# Altium schematic sheet Filter_R.SchDoc: Filter_R
size A3; SheetNumber: 1; SheetTotal: 5
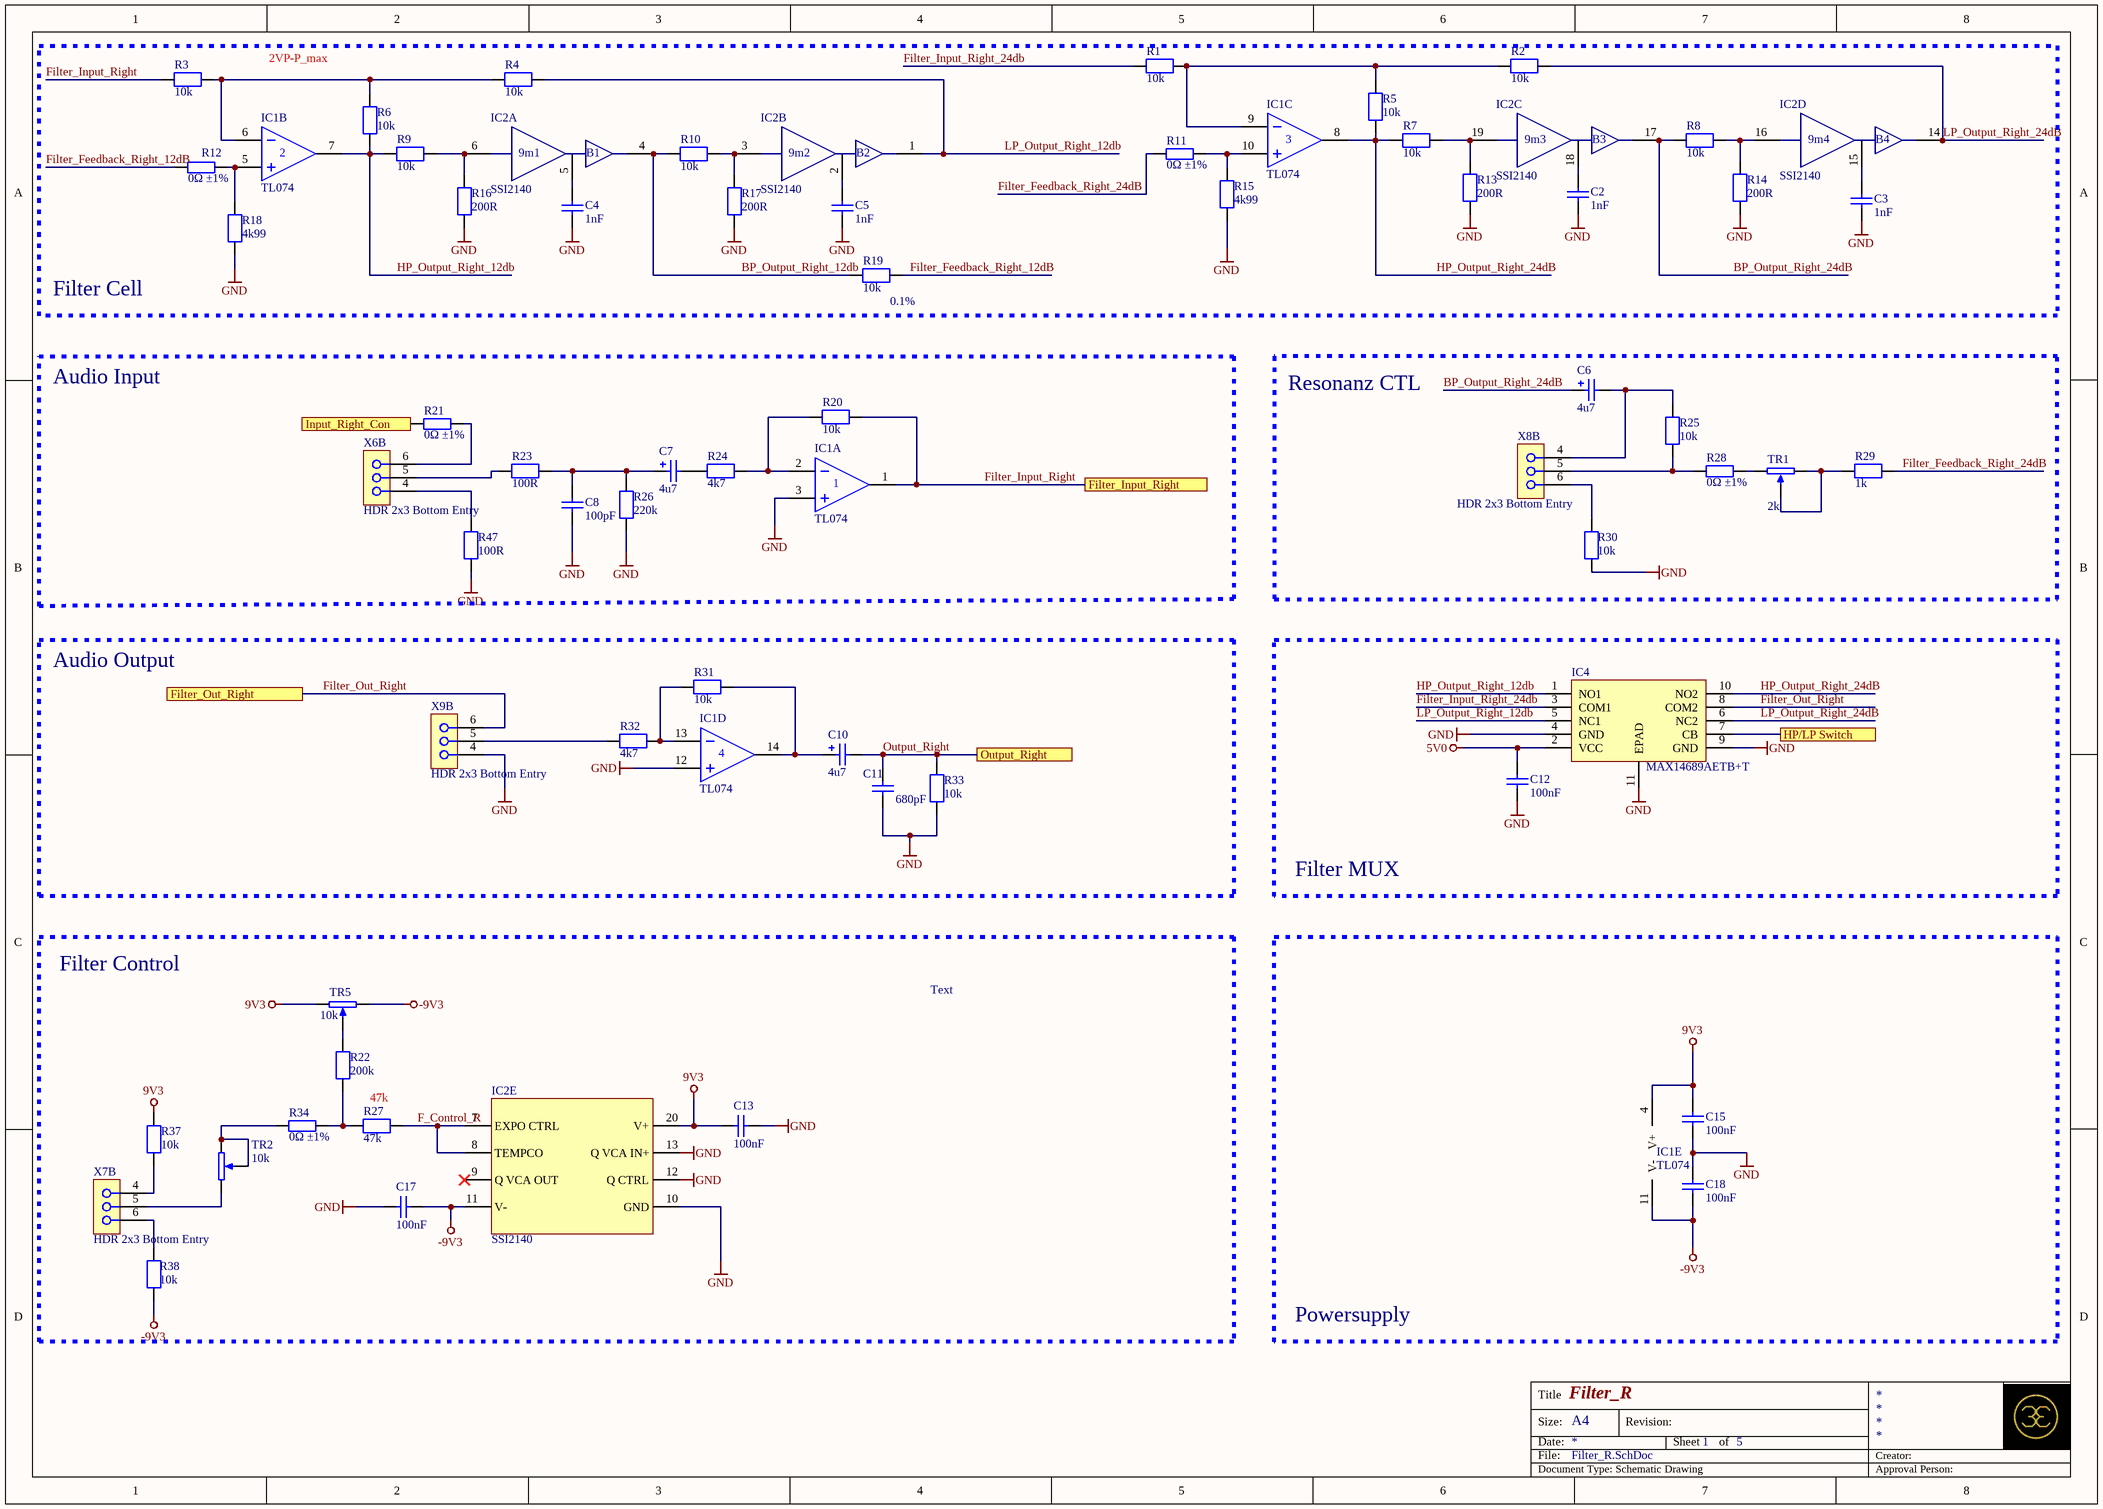
[diagram p0: Filter_R.SchDoc]

## Parts
C2  1nF  [CAPC2012X145N]  (no BOM)
C3  1nF  [CAPC2012X145N]  (no BOM)
C4  1nF  [CAPC2012X145N]  (no BOM)
C5  1nF  [CAPC2012X145N]  (no BOM)
C6  4u7  [CAPAE4643X54M]
C7  4u7  [CAPAE4643X54M]
C8  100pF  [CAPC2012X145N]
C10  4u7  [CAPAE4643X54M]
C11  680pF  [CAPC2012X145N]
C12  100nF  [CAPC1608X95N]
C13  100nF  [CAPC1608X95N]
C15  100nF  [CAPC1608X95N]
C17  100nF  [CAPC1608X95N]
C18  100nF  [CAPC1608X95N]
IC1  TL074  [SOIC127P600X175-14N]  (parts A,B,C,D,E of 5)
IC2  SSI2140  [SOP65P650-20N]  (parts A,B,C,D,E of 5)
IC4  MAX14689AETB+T  [QFN40P200X250X80_HS-11N]
R1  10k  [RESC2012X70N]
R2  10k  [RESC2012X70N]
R3  10k  [RESC2012X70N]
R4  10k  [RESC2012X70N]
R5  10k  [RESC2012X70N]
R6  10k  [RESC2012X70N]
R7  10k  [RESC2012X70N]
R8  10k  [RESC2012X70N]
R9  10k  [RESC2012X70N]
R10  10k  [RESC2012X70N]
R11  0Ω ±1%  [RESC2012X70N]
R12  0Ω ±1%  [RESC2012X70N]
R13  200R  [RESC2012X70N]
R14  200R  [RESC2012X70N]
R15  4k99  [RESC2012X70N]
R16  200R  [RESC2012X70N]
R17  200R  [RESC2012X70N]
R18  4k99  [RESC2012X70N]
R19  10k  [RESC2012X70N]
R20  10k  [RESC2012X70N]
R21  0Ω ±1%  [RESC2012X70N]
R22  200k  [RESC2012X70N]
R23  100R  [RESC2012X70N]
R24  4k7  [RESC2012X70N]
R25  10k  [RESC2012X70N]
R26  220k  [RESC2012X70N]
R27  47k  [RESC2012X70N]
R28  0Ω ±1%  [RESC2012X70N]
R29  1k  [RESC2012X70N]
R30  10k  [RESC2012X70N]
R31  10k  [RESC2012X70N]
R32  4k7  [RESC2012X70N]
R33  10k  [RESC2012X70N]
R34  0Ω ±1%  [RESC2012X70N]
R37  10k  [RESC2012X70N]
R38  10k  [RESC2012X70N]
R47  100R  [RESC2012X70N]
TR1  2k  [PVG3G503C01R00]
TR2  10k  [3296Y]
TR5  10k  [3296Y]
X6  HDR 2x3 Bottom Entry  [613006216921-poti]  (part B of 2)
X7  HDR 2x3 Bottom Entry  [613006216921-poti]  (part B of 2)
X8  HDR 2x3 Bottom Entry  [613006216921-poti]  (part B of 2)
X9  HDR 2x3 Bottom Entry  [613006216921-poti]  (part B of 2)

## Blocks framed on the sheet
Filter Cell: C2-C5 IC1 IC2 R1-R19
Audio Input: C7 C8 IC1 R20 R21 R23 R24 R26 R47 X6
Resonanz CTL: C6 R25 R28-R30 TR1 X8
Audio Output: C10 C11 IC1 R31-R33 X9
Filter MUX: C12 IC4
Filter Control: C13 C17 IC2 R22 R27 R34 R37 R38 TR2 TR5 X7
Powersupply: C15 C18 IC1

## Ports
Filter_Input_Right, Filter_Out_Right, HP/LP Switch, Input_Right_Con, Output_Right

## Nets
5V0: C12.2 IC4.2(VCC)
9V3: C13.1 C15.2 IC1.4(V+) IC2.20(V+) R37.2 TR5.1
-9V3: C17.2 C18.1 IC1.11(V-) IC2.11(V-) R38.1 TR5.3
GND: C2.1 C3.1 C4.1 C5.1 C8.1 C11.1 C12.1 C13.2 C15.1 C17.1 C18.2 IC1.3(IN+) IC1.12(IN+) IC2.10(GND) IC2.12(Q_CTRL) IC2.13(Q_VCA_IN+) IC4.4(GND) IC4.9(GND) IC4.11(EPAD) R13.1 R14.1 R15.1 R16.1 R17.1 R18.1 R26.1 R30.1 R33.1 R47.1 X9.4
BP_Output_Right_12db: IC2.4(OUT_1) R10.1 R19.1
BP_Output_Right_24dB: C6.1 IC2.17(OUT_3) R8.1
F_Control_R: IC2.7(EXPO_CTRL) IC2.8(TEMPCO) R27.2
Filter_Feedback_Right_12dB: R12.1 R19.2
Filter_Feedback_Right_24dB: R11.1 R29.1
Filter_Input_Right: IC1.1(OUT) R3.1 R20.1 ; port Filter_Input_Right
Filter_Input_Right_24db: IC4.3(COM1) R1.2
Filter_Out_Right: IC4.8(COM2) X9.6 ; port Filter_Out_Right
HP/LP Switch: IC4.7(CB) ; port HP/LP Switch
HP_Output_Right_12db: IC1.7(OUT) IC4.1(NO1) R6.1 R9.1
HP_Output_Right_24dB: IC1.8(OUT) IC4.10(NO2) R5.1 R7.1
Input_Right_Con: R21.1 ; port Input_Right_Con
LP_Output_Right_12db: IC2.1(OUT_2) IC4.5(NC1) R4.2
LP_Output_Right_24dB: IC2.14(OUT_4) IC4.6(NC2) R2.2
Output_Right: C10.2 C11.2 R33.2 ; port Output_Right
NetC2_2: C2.2 IC2.18(CAP_3)
NetC3_2: C3.2 IC2.15(CAP_4)
NetC4_2: C4.2 IC2.5(CAP_1)
NetC5_2: C5.2 IC2.2(CAP_2)
NetC6_2: C6.2 R25.2 X8.4
NetC7_1: C7.1 C8.2 R23.2 R26.2
NetC7_2: C7.2 R24.2
NetC10_1: C10.1 IC1.14(OUT) R31.1
NetIC1_2: IC1.2(IN-) R20.2 R24.1
NetIC1_5: IC1.5(IN+) R12.2 R18.2
NetIC1_6: IC1.6(IN-) R3.2 R4.1 R6.2
NetIC1_9: IC1.9(IN+) R1.1 R2.1 R5.2
NetIC1_10: IC1.10(IN-) R11.2 R15.2
NetIC1_13: IC1.13(IN-) R31.2 R32.1
NetIC2_3: IC2.3(IN_2) R10.2 R17.2
NetIC2_6: IC2.6(IN_1) R9.2 R16.2
NetIC2_16: IC2.16(IN_4) R8.2 R14.2
NetIC2_19: IC2.19(IN_3) R7.2 R13.2
NetR21_2: R21.2 X6.6
NetR22_1: R22.1 R27.1 R34.2
NetR22_2: R22.2 TR5.2
NetR23_1: R23.1 X6.5
NetR25_1: R25.1 R28.1 X8.5
NetR28_2: R28.2 TR1.1
NetR29_2: R29.2 TR1.2 TR1.3
NetR30_2: R30.2 X8.6
NetR32_2: R32.2 X9.5
NetR34_1: R34.1 TR2.2 TR2.3
NetR37_1: R37.1 X7.4
NetR38_2: R38.2 X7.6
NetR47_2: R47.2 X6.4
NetTR2_1: TR2.1 X7.5

Not connected (* = marked no-connect by the designer): IC2 9(Q_VCA_OUT)*

## Notes on the sheet
- 2VP-P_max
- (near R19) 0.1%
- Text
- 47k
- Title
- Size:
- Date:
- File:
- A4
- Revision:
- Sheet
- of
- Creator:
- Document Type: Schematic Drawing
- Approval Person:
- (in symbol IC_SSI2140, part A) 9m1; B1
- (in symbol IC_SSI2140, part B) 9m2; B2
- (in symbol IC_SSI2140, part C) 9m3; B3
- (in symbol IC_SSI2140, part D) 9m4; B4

## Library data of the parts
C2 C4 = CAP_1nF_630V: Multilayer Ceramic Capacitors MLCC - SMD/SMT, C0G(NP0), 100nF; Manufacturer: Murata Electronics; Manufacturer Part Number: GRM21B5C2J102JWA3L; Voltage Rating: 630VDC; Tolerance: 5%; Alternatives allowed: yes
C3 C5 = CAP_100nF_630V: Multilayer Ceramic Capacitors MLCC - SMD/SMT, C0G(NP0), 1nF; Manufacturer: Murata Electronics; Manufacturer Part Number: GRM21B5C2J102JWA3L; Voltage Rating: 630VDC; Tolerance: 5%; Alternatives allowed: yes
C6 C7 C10 = CAP_4u7: Aluminium Electrolytic Capacitors - SMD 4.7UF 16V ELECT VS BI-POLAR; Manufacturer: Panasonic; Manufacturer Part Number: EEE-1CA4R7NR; Tolerance: 20%; Alternatives allowed: NO; Voltage Rating: 16V
C8 = CAP_100pF_0805: Film Capacitors 100pF 50VDC 2% PPS FILM 0805; Manufacturer: Panasonic; Manufacturer Part Number: ECH-U1H101GX5; Voltage Rating: 50V; Alternatives allowed: NO; Tolerance: 2%
C11 = CAP_680pF_0805: Film Capacitors 680pF 50VDC 2% PPS FILM 0805; Manufacturer: Panasonic; Manufacturer Part Number: ECH-U1H681GX5; Voltage Rating: 50V; Alternatives allowed: NO; Tolerance: 2%
C12 C13 C15 C17 C18 = CAP_100nF_0603: Multilayer Ceramic Capacitors MLCC - SMD/SMT, 100nF; Manufacturer: YAGEO; Manufacturer Part Number: CC0603KRX7R9BB104; Voltage Rating: 50VDC; Tolerance: 10%; Alternatives allowed: yes; JLC: C14663
IC1 = IC_TL074: Operational Amplifiers - Op Amps Dual JFET Op Amp; Manufacturer: Texas Instruments; Manufacturer Part Number: TL074CDR; Alternatives allowed: NO
IC2 = IC_SSI2140: Voltage Controlled Multi-Mode Filter; Manufacturer: Sound Semiconductor; Alternatives allowed: NO; Manufacturer Part Number: SSI2140; JLC: *
IC4 = IC_MAX14689AETB+T: Analogue Switch ICs Ultra-Small, Low-RON, Beyond-the-Rails™, DPDT Analog Switches; Manufacturer: Maxim Integrated; Alternatives allowed: NO; Manufacturer Part Number: MAX14689AETB+T
R1-R10 R19 R20 R25 R31 R33 R37 = RES_10k_0805: Thick Film Resistors - SMD 1/8watt 10Kohms 1% 100ppm; Manufacturer: Vishay / Dale; Manufacturer Part Number: CRCW080510K0FKEA; Voltage Rating: 150V; Alternatives allowed: YES; Tolerance: 1%; JLC: C17414
R11 R12 R21 R28 R34 = 0805 0R (0R0) 1%: Chip resistor; Manufacturer Part Number: CRCW08050000Z0EAC; Manufacturer: Vishay / Dale; Alternatives allowed: YES; Tolerance: 1%; JLC: C17477
R13 R14 R16 R17 = RES_200R_0805: Thick Film Resistors - SMD 1/8watt 200ohms 1% 100ppm; Manufacturer: Vishay / Dale; Manufacturer Part Number: CRCW0805200RFKEA; Voltage Rating: 150V; Alternatives allowed: YES; Tolerance: 1%; JLC: C17540
R15 R18 = RES_4k99_0805: Thick Film Resistors - SMD 1/8watt 4.99Kohms 1% 100ppm; Manufacturer: Vishay / Dale; Manufacturer Part Number: CRCW08054K99FKEA; Voltage Rating: 150V; Alternatives allowed: YES; Tolerance: 1%; JLC: C17677
R22 = RES_200k_0805: Thick Film Resistors - SMD 1/8watt 200Kohms 1%; Manufacturer: Vishay / Dale; Manufacturer Part Number: CRCW0805200KFKEA; Voltage Rating: 150V; Alternatives allowed: YES; Tolerance: 1%; JLC: C17539
R23 R47 = RES_100R_0805: Thick Film Resistors 1/8watt 100ohms 1% 100ppm; Manufacturer: Vishay / Dale; Manufacturer Part Number: CRCW0805100RFKEA; Voltage Rating: 150V; Alternatives allowed: YES; Tolerance: 1%; JLC: C17408
R24 R32 = RES_4k7_0805: Thick Film Resistors - SMD 1/8Watt 4.7Kohms 1% Commercial Use; Manufacturer: Vishay / Dale; Manufacturer Part Number: CRCW08054K70FKEAC; Voltage Rating: 150V; Alternatives allowed: YES; Tolerance: 1%; JLC: C17673
R26 = RES_220k_0805: Thick Film Resistors - SMD 1/8watt 220Kohms 1%; Manufacturer: Vishay / Dale; Manufacturer Part Number: CRCW0805220KFKEA; Voltage Rating: 150V; Alternatives allowed: YES; Tolerance: 1%; JLC: C17556
R27 = RES_47k_0805: Thick Film Resistors - SMD 1/8watt 47Kohms 1%; Manufacturer: Vishay / Dale; Manufacturer Part Number: CRCW080547K0FKEB; Voltage Rating: 150V; Alternatives allowed: YES; Tolerance: 1%; JLC: C17713
R29 = RES_1k_0805: Thick Film Resistors - SMD 1/8watt 1Kohms 1% 100ppm; Manufacturer: Vishay / Dale; Manufacturer Part Number: CRCW08051K00FKEA; Voltage Rating: 150V; Alternatives allowed: YES; Tolerance: 1%; JLC: C17513
R30 R38 = RES_10k_0805: Thick Film Resistors - SMD 1/8watt 10Kohms 1% 100ppm; Manufacturer Part Number: CRCW080510K0FKEA; Manufacturer: Vishay / Dale; Alternatives allowed: YES; Voltage Rating: 150V; Tolerance: 1%; JLC: C17414
TR1 = TRIM_2k_lin: Trimmer Resistors - SMD 2.0Kohms Sealed 3mm Sngl turn; Manufacturer: Bourns; Manufacturer Part Number: PVG3A202C01R00; Tolerance: 20%
TR2 TR5 = TRIM_10k_lin_25: 10 kOhms 0.5W, 1/2W PC Pins Through Hole Trimmer Potentiometer Cermet 25.0 Turn Top Adjustment; Manufacturer: Bourns; Manufacturer Part Number: 3296Y-1-103LF; Tolerance: 10%
X6-X9 = CON_SOCKET_2x3_Poti: Printbuchse, Einführung unten, Board-to-Board, 2.54 mm, 2 Reihe(n), 4 Kontakt(e), Durchsteckmontage; Manufacturer: WE; Manufacturer Part Number: 613004216921; Alternatives allowed: YES